# Altium schematic sheet OSCILADOR-LOCAL.SchDoc: Oscilador de YIG referencia
size A4; Author: Mario de Miguel; Revision: 1; SheetNumber: 3; SheetTotal: 3; ProjectTitle: SWSH-Cross
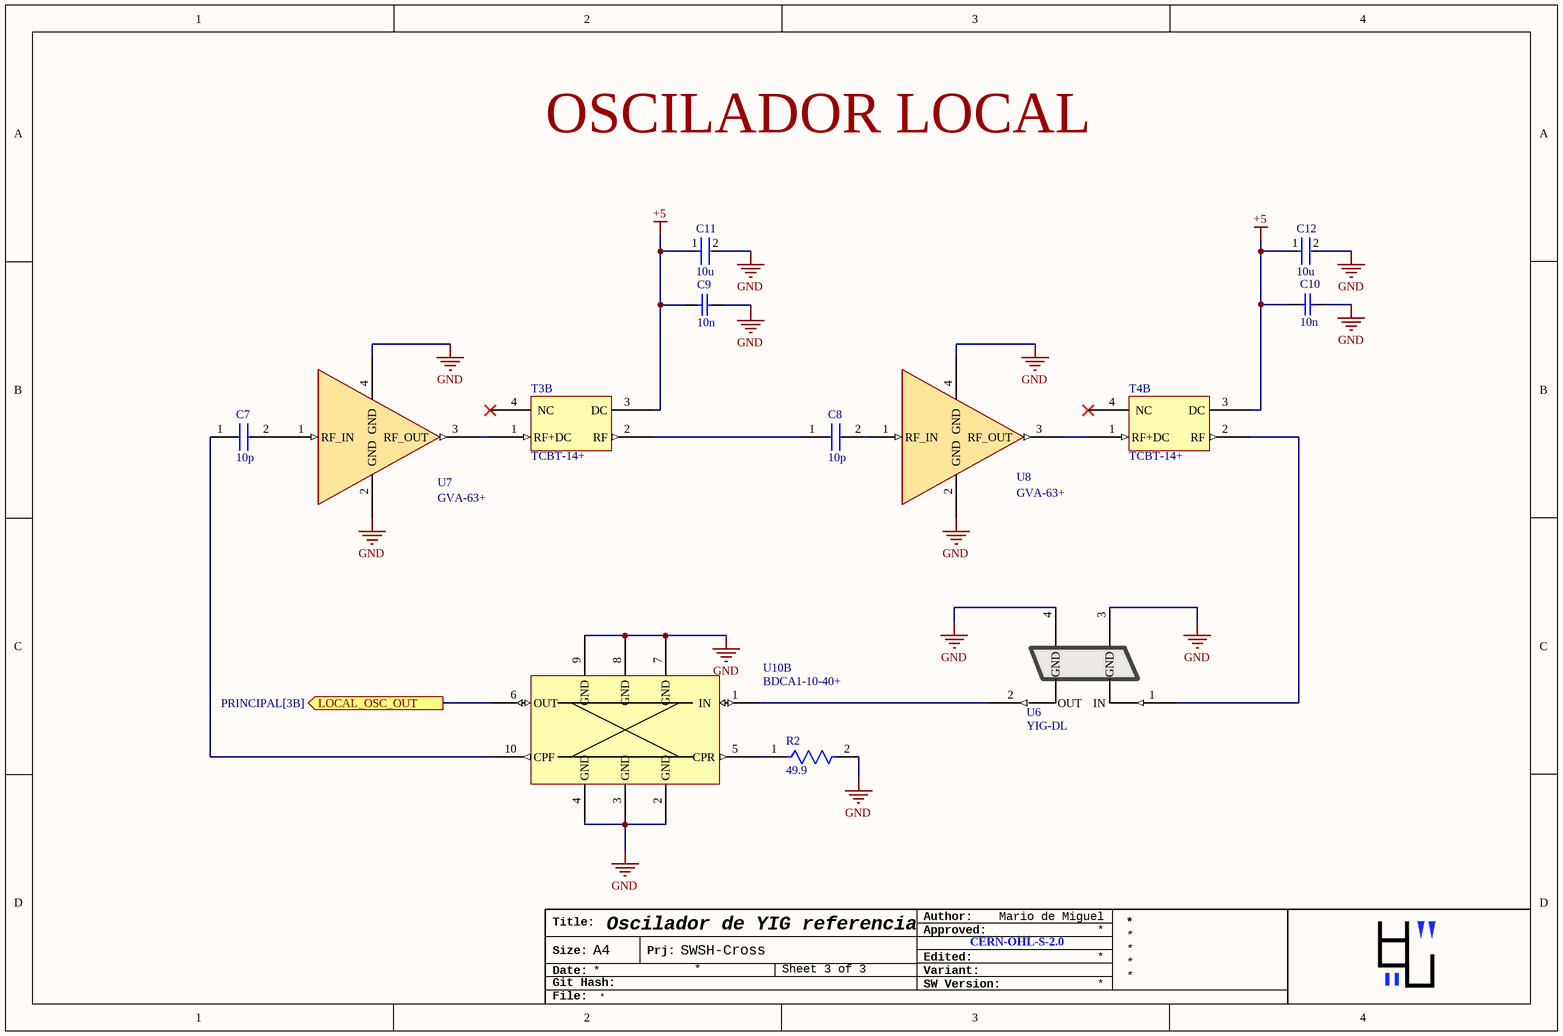
[diagram p0: OSCILADOR-LOCAL.SchDoc]

## Parts
C7  10p  [GRM1555C2A100FA01D]
C8  10p  [GRM1555C2A100FA01D]
C9  10n  [CAPC1608X90X35LL10T15]
C10  10n  [CAPC1608X90X35LL10T15]
C11  10u  [FP-GRM21B-0_1-MFG]
C12  10u  [FP-GRM21B-0_1-MFG]
R2  49.9  [FP-RNCP0603-IPC_C]
T3  TCBT-14+  [PL321-GU1414-TCBT-14+]  (part B of 2)
T4  TCBT-14+  [PL321-GU1414-TCBT-14+]  (part B of 2)
U6  YIG-DL  [YIG_DL_5mm-C]
U7  GVA-63+  [DF782-GVA-63+]
U8  GVA-63+  [DF782-GVA-63+]
U10  BDCA1-10-40+  [PL400-DZ944-BDCA1-10-40]  (part B of 2)

## Ports
LOCAL_OSC_OUT (out, see PRINCIPAL[3B])

## Nets
+5: C9.2 C10.2 C11.1 C12.1 T3.3(DC) T4.3(DC)
GND: C9.1 C10.1 C11.2 C12.2 R2.2 U6.3(GND) U6.4(GND) U7.2(GND) U7.4(GND) U8.2(GND) U8.4(GND) U10.2(GND) U10.3(GND) U10.4(GND) U10.7(GND) U10.8(GND) U10.9(GND)
LOCAL_OSC_OUT: U10.6(OUT) ; port LOCAL_OSC_OUT
NetC7_1: C7.1 U10.10(CPF)
NetC7_2: C7.2 U7.1(RF_IN)
NetC8_1: C8.1 T3.2(RF)
NetC8_2: C8.2 U8.1(RF_IN)
NetR2_1: R2.1 U10.5(CPR)
NetT3_1: T3.1(RF+DC) U7.3(RF_OUT)
NetT4_1: T4.1(RF+DC) U8.3(RF_OUT)
NetT4_2: T4.2(RF) U6.1(IN)
NetU6_2: U6.2(OUT) U10.1(IN)

Not connected (* = marked no-connect by the designer): T3 4(NC)*; T4 4(NC)*

## Notes on the sheet
- OSCILADOR LOCAL
- Title:
- Author:
- Approved:
- Size:
- Date:
- Git Hash:
- A4
- Prj:
- SW Version:
- Variant:
- Edited:
- CERN-OHL-S-2.0
- File:

## Library data of the parts
C7 C8 = GRM1555C2A100FA01D
C9 C10 = CMP-2006-02373-1: Part Number: GCM188R71H103KA37D; Manufacturer: Murata
C11 C12 = CMP-2007-03534-2: Chip Multilayer Ceramic Capacitors for General Purpose, 0805, 10uF, X5R, 15%, 10%, 16V; Case Code (Imperial): 0805; Packaging: Tape and Reel; Width: 0.049inch; Depth: 1.25mm; Voltage Rating: 16V; Height: 1.25mm; Case/Package: 0805; Max Operating Temperature: 85°C; Min Operating Temperature: -55°C; Tolerance: 10%; Dielectric: X5R; REACH SVHC: No SVHC; Mount: Surface Mount; Radiation Hardening: No; Case Code (Metric): 2012; Length: 2mm; Package Quantity: 10000; Voltage Rating (DC): 16V; Voltage: 16V; Capacitance: 10uF; Thickness: 0.053inch; Termination: SMD/SMT
R2 = CMP-26527-005229-1: 49.9Ω ±1% 0.125W 0603 High Power Anti-Sulfur Thin Film Chip Resistor; Temperature Coefficient: 100ppm/°C; Resistance: 49.9R; Max Power Dissipation: 125mW; Max Operating Temperature: 155°C; Resistor Type: Thin Film; Case Code (Metric): 1608; Case/Package: 0603; Tolerance: 1%; Length: 0.059inch; Mount: Surface Mount; Case Code (Imperial): 0603; Features: Moisture Resistant; Series: RNCP; Height: 0.02inch; Min Operating Temperature: -55°C; Number of Terminations: 2; Packaging: Cut Tape; Width: 0.031inch; Lead Free: Lead Free; RoHS Compliant: Yes